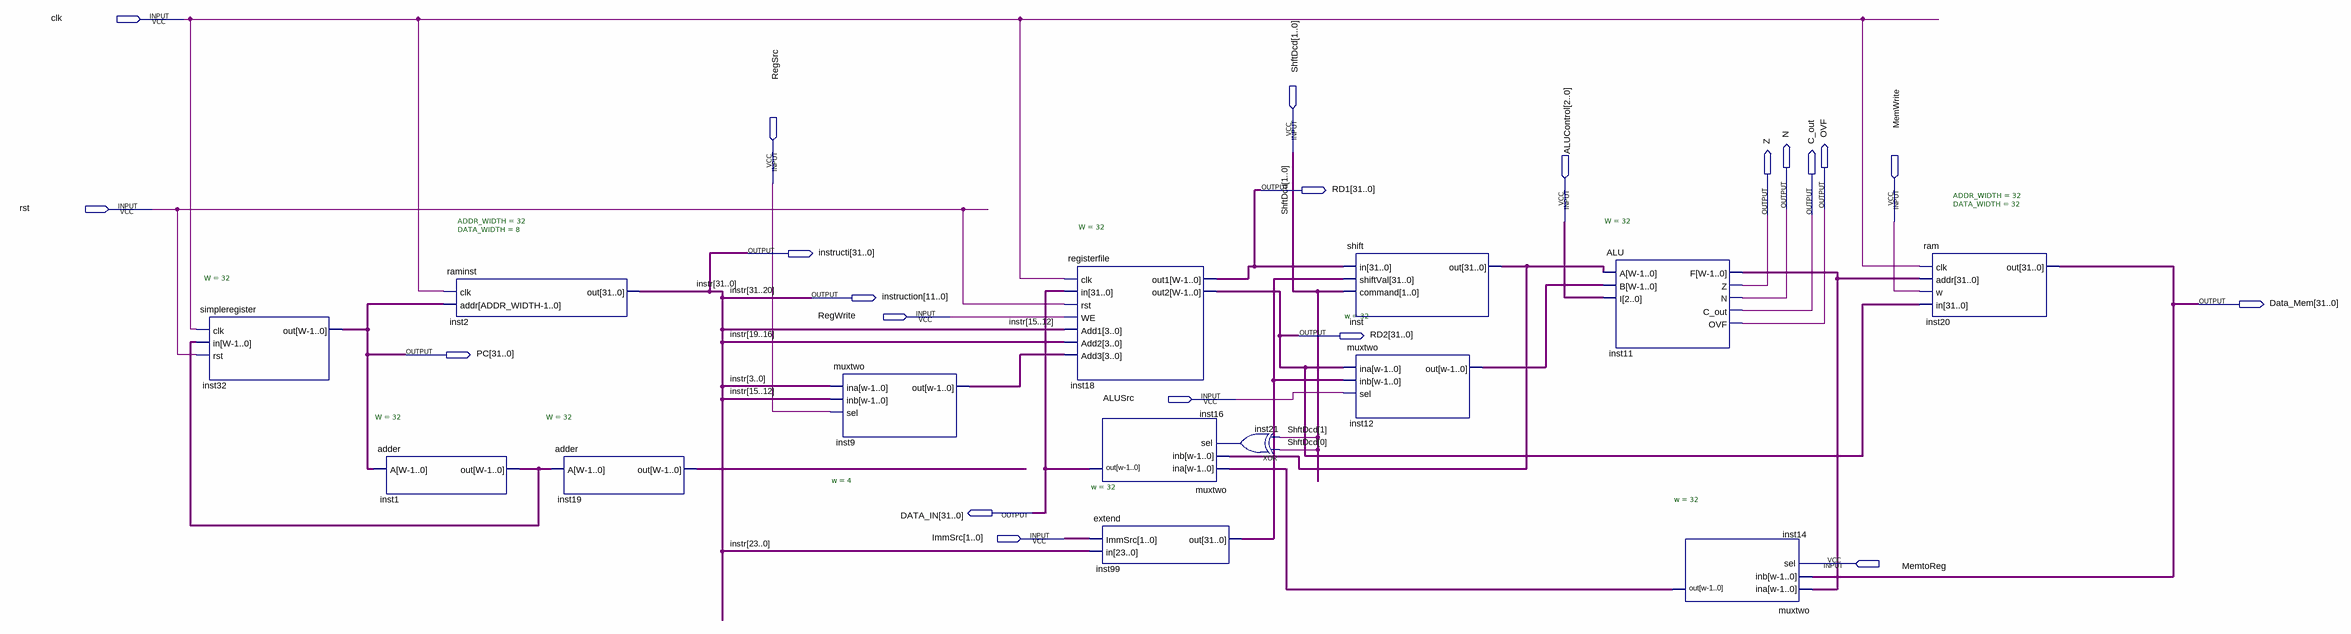
[diagram p0: schematic sheet]
// Quartus schematic third.bdf as structural Verilog: 14 symbols, 21 pins
module third (
  input  clk,
  input  [1:0] ShftDcd,
  input  RegSrc,
  input  rst,
  input  [2:0] ALUControl,
  input  MemWrite,
  input  RegWrite,
  input  ALUSrc,
  input  [1:0] ImmSrc,
  input  MemtoReg,
  output [31:0] RD1,
  output N,
  output OVF,
  output Z,
  output C_out,
  output [31:0] instructi,
  output [11:0] instruction,
  output [31:0] Data_Mem,
  output [31:0] RD2,
  output [31:0] PC,
  output [31:0] DATA_IN
);

  wire inst21_out;
  wire [3:0] inst9_out;
  wire [31:0] inst1_out, inst11_f, inst12_out, inst14_out, inst19_out, inst99_out, inst_out;

  simpleregister #(.W(32)) inst32 (.clk(clk), .in(inst1_out), .rst(rst), .out(PC));
  adder #(.W(32)) inst1 (.A(PC), .out(inst1_out));
  raminst #(.ADDR_WIDTH(32), .DATA_WIDTH(8)) inst2 (.clk(clk), .addr(PC), .out(instructi));
  adder #(.W(32)) inst19 (.A(inst1_out), .out(inst19_out));
  muxtwo #(.w(4)) inst9 (.ina(instructi[3:0]), .inb(instructi[15:12]), .sel(RegSrc), .out(inst9_out));
  registerfile #(.W(32)) inst18 (
    .clk(clk), .in(DATA_IN), .rst(rst), .WE(RegWrite), .Add1(instructi[15:12]), .Add2(instructi[19:16]),
    .Add3(inst9_out), .out1(RD1), .out2(RD2));
  muxtwo #(.w(32)) inst16 (.ina(inst14_out), .inb(inst_out), .sel(inst21_out), .out(DATA_IN));
  extend inst99 (.ImmSrc(ImmSrc), .in(instructi[23:0]), .out(inst99_out));
  xor inst21 (inst21_out, ShftDcd[0], ShftDcd[1]);
  shift inst (.in(RD1), .shiftVal(inst99_out), .command(ShftDcd), .out(inst_out));
  muxtwo #(.w(32)) inst12 (.ina(RD2), .inb(inst99_out), .sel(ALUSrc), .out(inst12_out));
  ALU #(.W(32)) inst11 (
    .A(inst_out), .B(inst12_out), .I(ALUControl), .F(inst11_f), .Z(Z), .N(N), .C_out(C_out), .OVF(OVF));
  muxtwo #(.w(32)) inst14 (.ina(inst11_f), .inb(Data_Mem), .sel(MemtoReg), .out(inst14_out));
  ram #(.ADDR_WIDTH(32), .DATA_WIDTH(32)) inst20 (.clk(clk), .addr(inst11_f), .w(MemWrite), .in(RD2), .out(Data_Mem));

  assign instruction = instructi[31:20];

  // Other names for the same wires on the sheet: instr[31:0] = instructi
endmodule
